# EAGLE design USB_Analog_Controller (EAGLE 9.6.2)
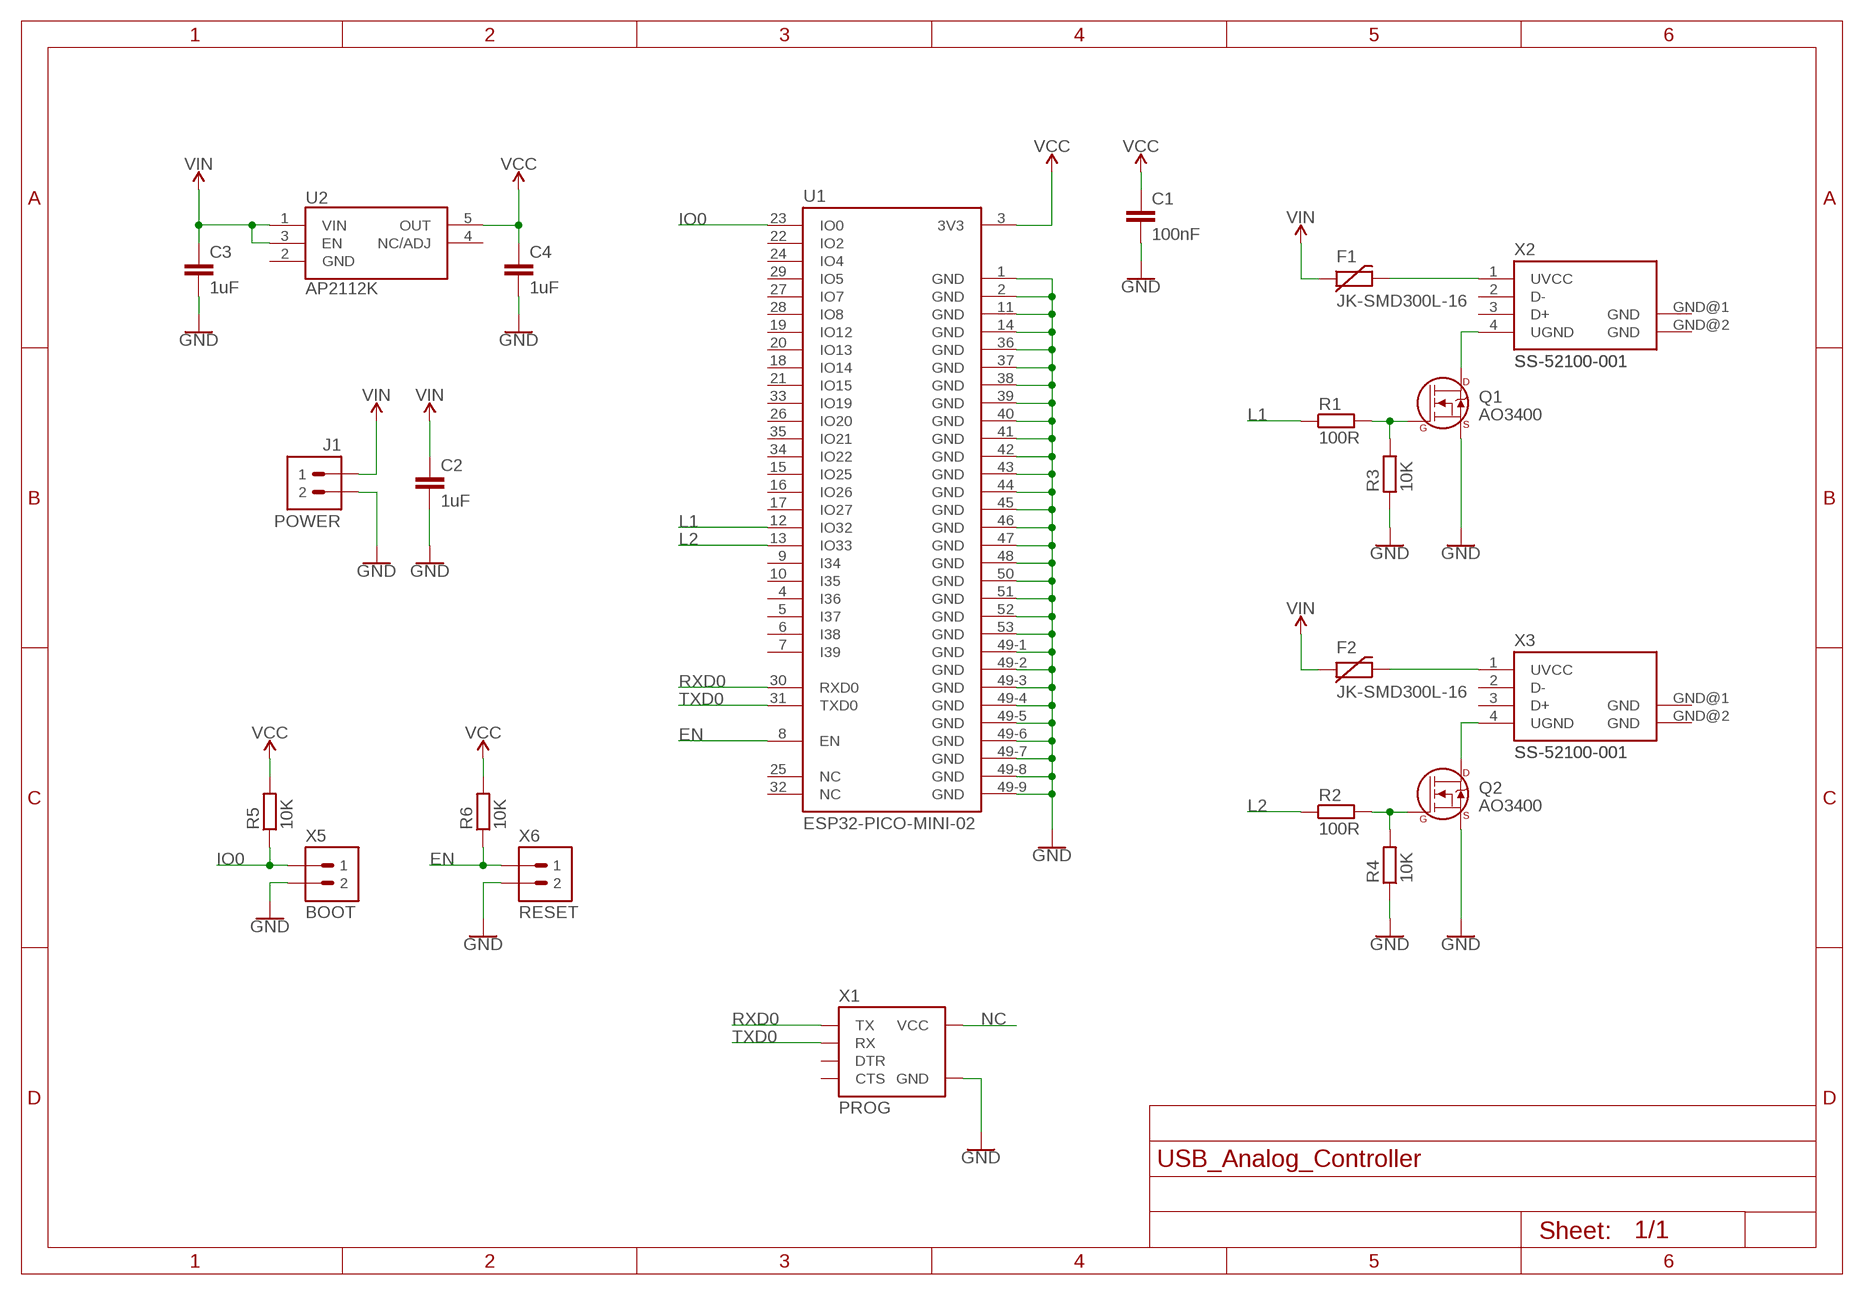
[diagram p0: schematic, sheet 1]

## Parts
C1  100nF  CAPC0603  [C0603]
C2  1uF  CAPC0603  [C0603]
C3  1uF  CAPC0603  [C0603]
C4  1uF  CAPC0603  [C0603]
F1  JK-SMD300L-16  PTCJK-SMD300  [JK-SMD300]
F2  JK-SMD300L-16  PTCJK-SMD300  [JK-SMD300]
J1  POWER  TERMINAL-1X02-2.54P  [TERMINAL-2.54-2P]
Q1  AO3400  MOSFET-NCHSOT23-3  [SOT23-3]
Q2  AO3400  MOSFET-NCHSOT23-3  [SOT23-3]
R1  100R  RESISTOR0603  [R0603]
R2  100R  RESISTOR0603  [R0603]
R3  10K  RESISTOR0603  [R0603]
R4  10K  RESISTOR0603  [R0603]
R5  10K  RESISTOR0603  [R0603]
R6  10K  RESISTOR0603  [R0603]
U1  ESP32-PICO-MINI-02  [ESP32-PICO-MINI-02]
U2  AP2112K  REGULATOR-AP2112KK-SOT23-5  [SOT23-5]
X1  PROG  HEADER-FTDI232  [FTDI232-1X06]
X2  SS-52100-001  USB-ASS-52100-001  [USB-A-SS-52100-001]
X3  SS-52100-001  USB-ASS-52100-001  [USB-A-SS-52100-001]
X5  BOOT  HEADER-1X02-2.54  [1X02-2.54]
X6  RESET  HEADER-1X02-2.54  [1X02-2.54]

## Nets
EN: R6.1 U1.8(EN) X6.1
GND: C1.2 C2.2 C3.2 C4.2 J1.2 Q1.2(S) Q2.2(S) R3.1 R4.1 U1.1(GND) U1.2(GND) U1.11(GND) U1.14(GND) U1.36(GND) U1.37(GND) U1.38(GND) U1.39(GND) U1.40(GND) U1.41(GND) U1.42(GND) U1.43(GND) U1.44(GND) U1.45(GND) U1.46(GND) U1.47(GND) U1.48(GND) U1.49-1(GND) U1.49-2(GND) U1.49-3(GND) U1.49-4(GND) U1.49-5(GND) U1.49-6(GND) U1.49-7(GND) U1.49-8(GND) U1.49-9(GND) U1.50(GND) U1.51(GND) U1.52(GND) U1.53(GND) X1.GND X5.2 X6.2
IO0: R5.1 U1.23(IO0) X5.1
L1: R1.1 U1.12(IO32)
L2: R2.1 U1.13(IO33)
N$1: Q1.3(D) X2.4(UGND)
N$2: Q2.3(D) X3.4(UGND)
N$3: Q2.1(G) R2.2 R4.2
N$4: Q1.1(G) R1.2 R3.2
N$5: F1.B X2.1(UVCC)
N$6: F2.B X3.1(UVCC)
NC: X1.VCC
RXD0: U1.30(RXD0) X1.TX
TXD0: U1.31(TXD0) X1.RX
VCC: C1.1 C4.1 R5.2 R6.2 U1.3(3V3) U2.5(OUT)
VIN: C2.1 C3.1 F1.A F2.A J1.1 U2.1(VIN) U2.3(EN)
Unconnected: U1.4(I36) U1.5(I37) U1.6(I38) U1.7(I39) U1.9(I34) U1.10(I35) U1.15(IO25) U1.16(IO26) U1.17(IO27) U1.18(IO14) U1.19(IO12) U1.20(IO13) U1.21(IO15) U1.22(IO2) U1.24(IO4) U1.25(NC) U1.26(IO20) U1.27(IO7) U1.28(IO8) U1.29(IO5) U1.32(NC) U1.33(IO19) U1.34(IO22) U1.35(IO21) U2.4(NC/ADJ) X1.CTS X1.DTR X2.2(D-) X2.3(D+) X2.GND@1(GND) X2.GND@2(GND) X3.2(D-) X3.3(D+) X3.GND@1(GND) X3.GND@2(GND)

## Power pins joined to a net without a drawn wire
GND: U2.2(GND)

## Library data of the parts
C1-C4 = M2M-Passives:CAP
F1 F2 = M2M-Fuse:PTC
J1 = M2M-Connectors:TERMINAL-1X02-2.54
Q1 Q2 = M2M-DiscreteSemi:MOSFET-NCH
R1-R6 = M2M-Passives:RESISTOR
U1 = M2M-Modules:ESP32-PICO-MINI-02
U2 = M2M-IC:REGULATOR-AP2112K
X1 = M2M-Connectors:HEADER-FTDI232
X2 X3 = M2M-Connectors:USB-A
X5 X6 = M2M-Connectors:HEADER-1X02-2.54

## Board
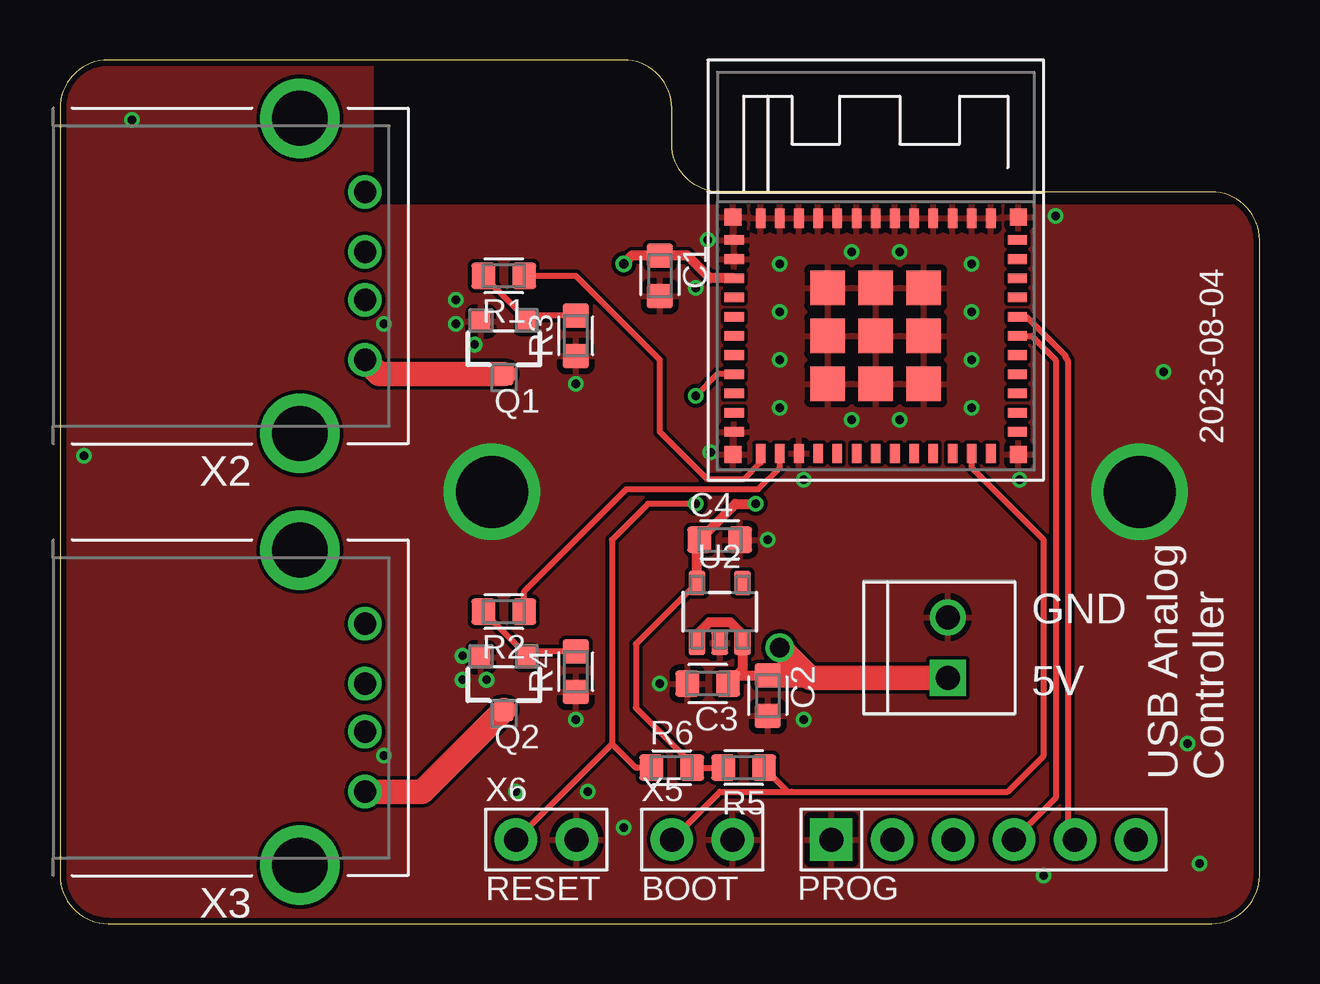
[diagram p1: board, top side]
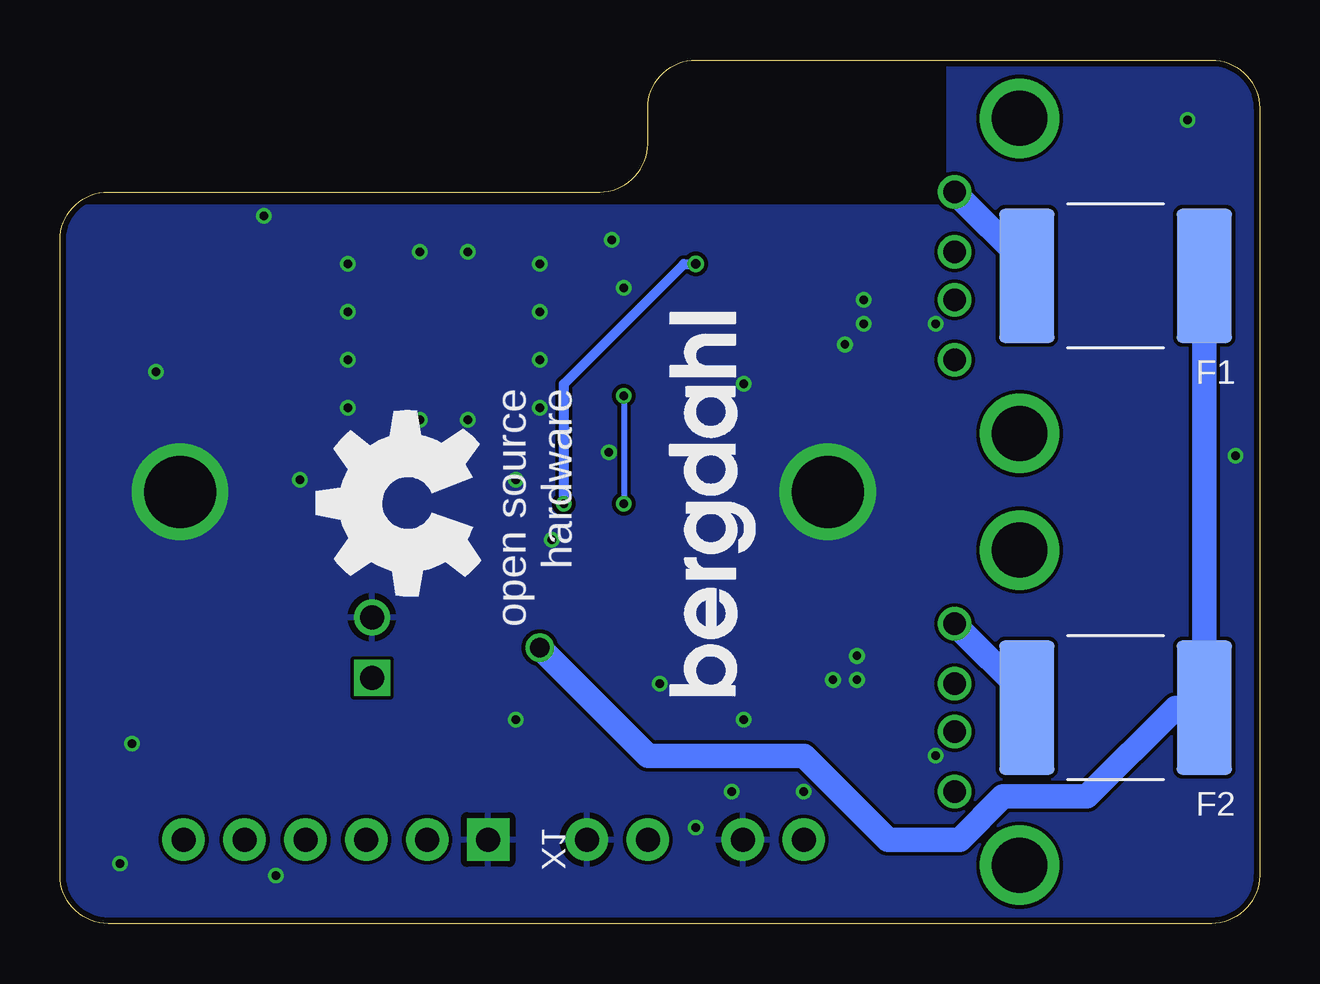
[diagram p2: board, bottom side, seen from below]

Size 50 x 36 mm. Coordinates in mm from the lower left corner, seen from the top.
Outline: 0,34 0,2 arc90 2,0 48,0 arc90 50,2 50,28.5 arc90 48,30.5 27.5,30.5 arc-90 25.5,32.5 25.5,34 arc90 23.5,36 2,36 arc90 0,34
Copper layers (1*16): Top 0.035mm / dielectric 1.5mm / Bottom 0.035mm
Design rules "SeeedStudio_2layer_DRU_no_angle_20140221": minimum track width 6mil, minimum drill 0.3mm, track to track 6mil, track to pad 6mil, pad to pad 6mil, via to via 6mil, smd to smd 0mil, copper to edge 10mil, drill to drill 10mil, minimum pad ring 2mil, minimum via ring 6mil, stop-mask expansion 2mil, vias tented up to drill 1000mil, thermal gap 10mil

### Footprints (pad centres in the part's own frame; a part is rotated, then mirrored left to right if it is on the bottom)
C0603 = smd 1 x 1.1: 1 -0.85,0; 2 0.85,0
JK-SMD300 = smd 2.3 x 5.6: A -3.7,0; B 3.7,0
TERMINAL-2.54-2P = drill 1 square: 1 -1.27,0 | drill 1: 2 1.27,0
SOT23-3 = smd 0.8 x 0.9: 1 -0.95,-1.1; 2 0.95,-1.1; 3 0,1.1
R0603 = smd 1 x 1.1: 1 -0.85,0; 2 0.85,0
ESP32-PICO-MINI-02 = smd 0.8 x 0.4: 1 -5.9,4; 2 -5.9,3.2; 3 -5.9,2.4; 4 -5.9,1.6; 5 -5.9,0.8; 6 -5.9,0; 7 -5.9,-0.8; 8 -5.9,-1.6; 9 -5.9,-2.4; 10 -5.9,-3.2; 11 -5.9,-4; 25 5.9,-4; 26 5.9,-3.2; 27 5.9,-2.4; 28 5.9,-1.6; 29 5.9,-0.8; 30 5.9,0; 31 5.9,0.8; 32 5.9,1.6; 33 5.9,2.4; 34 5.9,3.2; 35 5.9,4 | smd 0.4 x 0.8: 12 -4.8,-4.9; 13 -4,-4.9; 14 -3.2,-4.9; 15 -2.4,-4.9; 16 -1.6,-4.9; 17 -0.8,-4.9; 18 0,-4.9; 19 0.8,-4.9; 20 1.6,-4.9; 21 2.4,-4.9; 22 3.2,-4.9; 23 4,-4.9; 24 4.8,-4.9; 36 4.8,4.9; 37 4,4.9; 38 3.2,4.9; 39 2.4,4.9; 40 1.6,4.9; 41 0.8,4.9; 42 0,4.9; 43 -0.8,4.9; 44 -1.6,4.9; 45 -2.4,4.9; 46 -3.2,4.9; 47 -4,4.9; 48 -4.8,4.9 | smd 1.45 x 1.45: 49-1 -2,2; 49-2 0,2; 49-3 2,2; 49-4 -2,0; 49-5 0,0; 49-6 2,0; 49-7 -2,-2; 49-8 0,-2; 49-9 2,-2 | smd 0.7 x 0.7: 50 5.95,4.95; 51 5.95,-4.95; 52 -5.95,-4.95; 53 -5.95,4.95
SOT23-5 = smd 0.7 x 1: 1 -0.95,-1.3; 2 0,-1.3; 3 0.95,-1.3; 4 0.95,1.2; 5 -0.95,1.2
FTDI232-1X06 = drill 1 pad 1.778: CTS 0,3.81; DTR 0,-6.35; RX 0,-3.81; TX 0,-1.27; VCC 0,1.27 | drill 1 pad 1.778 square: GND 0,6.35
USB-A-SS-52100-001 = drill 0.92: 1 3.5,-2.71; 2 1,-2.71; 3 -1,-2.71; 4 -3.5,-2.71 | drill 2.3: GND@1 -6.57,0; GND@2 6.57,0
1X02-2.54 = drill 1 pad 1.778: 1 0,0; 2 2.54,0

### Placement (x,y rotation side)
C1  25,27 270 top
C2  29.5,9.5 270 top
C3  27,10 180 top
C4  27.5,16 0 top
F1  6,27 180 bottom
F2  6,9 180 bottom
J1  37,11.5 90 top
Q1  18.5,24 180 top
Q2  18.5,10 180 top
R1  18.5,27 180 top
R2  18.5,13 180 top
R3  21.5,24.5 90 top
R4  21.5,10.5 90 top
R5  28.5,6.5 180 top
R6  25.5,6.5 0 top
U1  34,24.5 0 top
U2  27.5,13 0 top
U$1  [BERGDAHL-20MM-BPLACE]  21,25.5 270 top
U$2  [OSHW-8MM-BPLACE]  35.5,17.5 270 top
X1  38.5,3.5 90 top
X2  10,27 90 top
X3  10,9 90 top
X5  25.5,3.5 0 top
X6  19,3.5 0 top

### Tracks (layer width: path | path; a pad name or v marks a point on that pad's centre or on a via)
EN  (via drill 0.35)
  Top 0.254: U1.8 27.4,22.9 v26.5,22 | 23,7.5 X6.1 | v26.5,17.5 24.5,17.5 23,16 23,7.5 | R6.1 24,6.5 23,7.5
  Bottom 0.254: v26.5,22 v26.5,17.5
GND  (via drill 0.35, 3)
  other vias: 18,18 45,18 30,27.5 30,25.5 30,23.5 30,21.5 33,21 35,21 38,21.5 38,23.5 38,25.5 38,27.5 35,28 33,28 41.5,29.5 26.5,26.5 27,28.5 40,18.5 31,18.5 27.12,19.64 47.5,2.5 46,23 47,7.5 41,2 23.5,4 22,5.5 19,5.5 1,19.5 3,33.5 16.5,25 16.5,26 17.28,24.14 17.78,10.16 16.78,11.16 16.78,10.16 13.5,7 13.5,25 29.5,16 31,8.5 25,10 21.5,8.5 21.5,22.5
  pour Top: 0,36 13,36 13,30 50,30 50,0 0,0
  pour Bottom: 0,36 13,36 13,30 50,30 50,0 0,0
IO0
  Top 0.254: U1.23 38,19 41,16 41,7 39.5,5.5 30.5,5.5 30.35,5.5 | X5.1 27.5,5.5 30.35,5.5 | R5.1 30.35,5.5
L1
  Top 0.254: R1.1 21.5,27 25,23.5 25,20.5 26.99,18.51 28.5,18.51 29.2,19.21 U1.12
L2
  Top 0.254: R2.1 19.35,13.85 23.61,18.11 29.11,18.11 30,19 U1.13
N$1
  Top 1.016: Q1.3 13.31,22.9 X2.4
N$2
  Top 1.016: Q2.3 15.1,5.5 X3.4
N$3
  Top 0.254: R2.2 19.45,11.2 Q2.1 19.7,11.35 R4.2
N$4
  Top 0.254: R1.2 19.45,25.2 Q1.1 19.7,25.35 R3.2
N$5
  Bottom 1.016: X2.1 9.7,27.49 F1.B
N$6
  Bottom 1.016: X3.1 9.7,9.49 F2.B
RXD0
  Top 0.254: U1.30 40.5,24.5 41.5,23.5 41.5,5.23 X1.TX
TXD0
  Top 0.254: U1.31 40.27,25.3 41.91,23.67 41.91,23.59 42,23.5 42,3.81 X1.RX
VCC  (via drill 0.35, 0.4)
  Top 0.254: R6.2 26.5,6.5 | 26.5,6.5 R5.2 | U2.5 24,11.65 24,9 26.5,6.5
  Top 0.406: U1.3 27.1,26.9 26.15,27.85 C1.1 23.85,27.85 v23.5,27.5 | U2.5 26.55,15.9 C4.1 28.15,17.5 v29,17.5
  Bottom 0.406: v29,17.5 29,22.5 24,27.5 v23.5,27.5
VIN  (via drill 0.8)
  Top 0.406: C2.1 28.2,10.35 C3.1 28.45,10.6 U2.3 28.45,12.05 27.95,12.56 27.05,12.56 26.55,12.05 U2.1
  Top 1.016: J1.1 31.27,10.23 31.15,10.35 | 31.15,10.35 v30,11.5 | C2.1 31.15,10.35
  Bottom 1.016: v30,11.5 25.5,7 19,7 15.5,3.5 12.5,3.5 10.7,5.3 7.2,5.3 3.5,9 F2.A F1.A

### Text on the board
tPlace: 2023-08-04 | GND | 5V | USB Analog / Controller
Measures: Mounting holes / 2x3mm